# Altium schematic sheet iDAC1.SchDoc: Laser PCB
size A3; DrawnBy: James Singleton; Organization: TMC Technology Ltd.; DocumentNumber: 2; Revision: A; SheetNumber: 3; SheetTotal: 18; Drawn Date: 22/12/2020
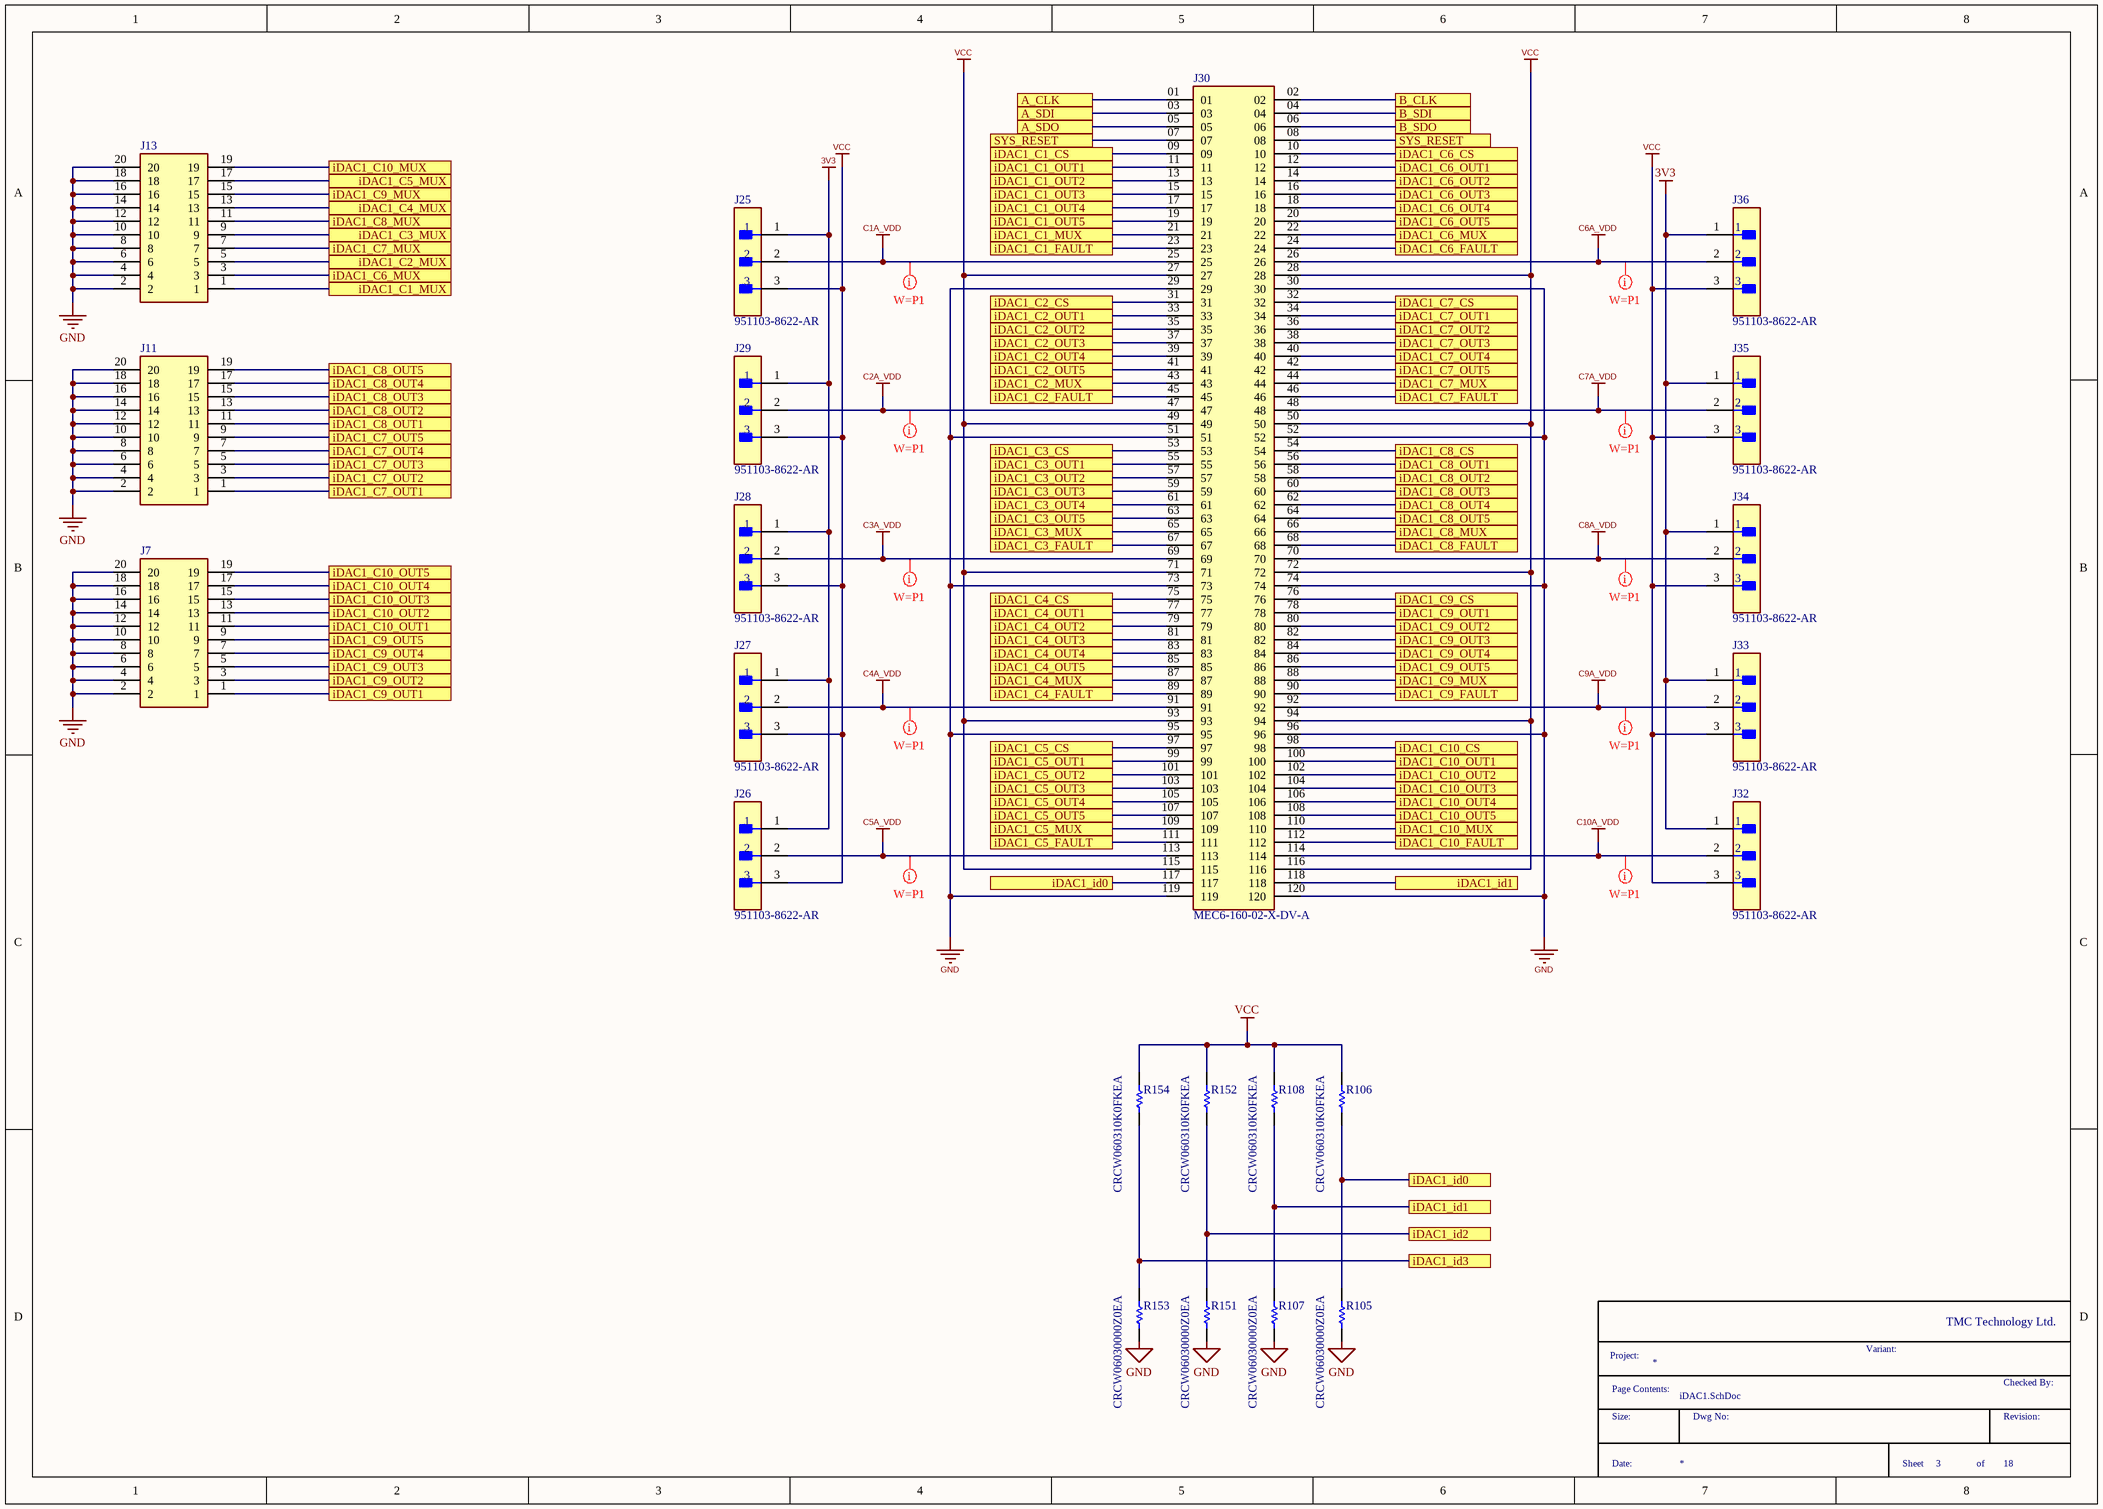
[diagram p0: iDAC1.SchDoc]

## Parts
J7  (no value)  [HDRV20W40P127_2X10_1270X340X550P]
J11  (no value)  [HDRV20W40P127_2X10_1270X340X550P]
J13  (no value)  [HDRV20W40P127_2X10_1270X340X550P]
J25  951103-8622-AR  [FP-951103-8622-AR-MFG]
J26  951103-8622-AR  [FP-951103-8622-AR-MFG]
J27  951103-8622-AR  [FP-951103-8622-AR-MFG]
J28  951103-8622-AR  [FP-951103-8622-AR-MFG]
J29  951103-8622-AR  [FP-951103-8622-AR-MFG]
J30  MEC6-160-02-X-DV-A  [SAMTEC_MEC6-160-02-X-DV-A]
J32  951103-8622-AR  [FP-951103-8622-AR-MFG]
J33  951103-8622-AR  [FP-951103-8622-AR-MFG]
J34  951103-8622-AR  [FP-951103-8622-AR-MFG]
J35  951103-8622-AR  [FP-951103-8622-AR-MFG]
J36  951103-8622-AR  [FP-951103-8622-AR-MFG]
R105  CRCW06030000Z0EA  [RESC1609X50X30NL8T20]
R106  CRCW060310K0FKEA  [RESC1609X50X30NL8T20]
R107  CRCW06030000Z0EA  [RESC1609X50X30NL8T20]
R108  CRCW060310K0FKEA  [RESC1609X50X30NL8T20]
R151  CRCW06030000Z0EA  [RESC1609X50X30NL8T20]
R152  CRCW060310K0FKEA  [RESC1609X50X30NL8T20]
R153  CRCW06030000Z0EA  [RESC1609X50X30NL8T20]
R154  CRCW060310K0FKEA  [RESC1609X50X30NL8T20]

## Ports
A_CLK (see iDAC2[4A], PI_INTERFACE[2B], vDAC1[4A], vDAC2[4A]), A_SDI (see iDAC2[4A], PI_INTERFACE[2B], vDAC1[4A], vDAC2[4A]), A_SDO (see iDAC2[4A], PI_INTERFACE[1B], vDAC1[4A], vDAC2[4A]), B_CLK (see iDAC2[6A], PI_INTERFACE[2B], vDAC1[5A], vDAC2[5A]), B_SDI (see iDAC2[6A], PI_INTERFACE[2B], vDAC1[5A], vDAC2[5A]), B_SDO (see iDAC2[6A], PI_INTERFACE[1B], vDAC1[5A], vDAC2[5A]), iDAC1_C1_CS (see ChipSelects+Faults[6A]), iDAC1_C1_FAULT (see ChipSelects+Faults[1A]), iDAC1_C1_MUX (see iDAC1[2A]), iDAC1_C1_MUX (see iDAC1[4A]), iDAC1_C1_OUT1 (see TX_FlexiConnectors[3A]), iDAC1_C1_OUT2 (see TX_FlexiConnectors[3A]), iDAC1_C1_OUT3 (see TX_FlexiConnectors[3A]), iDAC1_C1_OUT4 (see TX_FlexiConnectors[3A]), iDAC1_C1_OUT5 (see TX_FlexiConnectors[3A]), iDAC1_C2_CS (see ChipSelects+Faults[6A]), iDAC1_C2_FAULT (see ChipSelects+Faults[1A]), iDAC1_C2_MUX (see iDAC1[2A]), iDAC1_C2_MUX (see iDAC1[4B]), iDAC1_C2_OUT1 (see TX_FlexiConnectors[3A]), iDAC1_C2_OUT2 (see TX_FlexiConnectors[3A]), iDAC1_C2_OUT3 (see TX_FlexiConnectors[3A]), iDAC1_C2_OUT4 (see TX_FlexiConnectors[3A]), iDAC1_C2_OUT5 (see TX_FlexiConnectors[3B]), iDAC1_C3_CS (see ChipSelects+Faults[6B]), iDAC1_C3_FAULT (see ChipSelects+Faults[4B]), iDAC1_C3_MUX (see iDAC1[2A]), iDAC1_C3_MUX (see iDAC1[4B]), iDAC1_C3_OUT1 (see TX_FlexiConnectors[3B]), iDAC1_C3_OUT2 (see TX_FlexiConnectors[3C]), iDAC1_C3_OUT3 (see TX_FlexiConnectors[3C]), iDAC1_C3_OUT4 (see TX_FlexiConnectors[3C]), iDAC1_C3_OUT5 (see TX_FlexiConnectors[3C]), iDAC1_C4_CS (see ChipSelects+Faults[6B]), iDAC1_C4_FAULT (see ChipSelects+Faults[1B]), iDAC1_C4_MUX (see iDAC1[2A]), iDAC1_C4_MUX (see iDAC1[4B]), iDAC1_C4_OUT1 (see TX_FlexiConnectors[3C]), iDAC1_C4_OUT2 (see TX_FlexiConnectors[3C]), iDAC1_C4_OUT3 (see TX_FlexiConnectors[3C]), iDAC1_C4_OUT4 (see TX_FlexiConnectors[3C]), iDAC1_C4_OUT5 (see TX_FlexiConnectors[3C]), iDAC1_C5_CS (see ChipSelects+Faults[6B]), iDAC1_C5_FAULT (see ChipSelects+Faults[1B]), iDAC1_C5_MUX (see iDAC1[2A]), iDAC1_C5_MUX (see iDAC1[4C]), iDAC1_C5_OUT1 (see TX_FlexiConnectors[3C]), iDAC1_C5_OUT2 (see TX_FlexiConnectors[1C]), iDAC1_C5_OUT3 (see TX_FlexiConnectors[1C]), iDAC1_C5_OUT4 (see TX_FlexiConnectors[1C]), iDAC1_C5_OUT5 (see TX_FlexiConnectors[1C]), iDAC1_C6_CS (see ChipSelects+Faults[6B]), iDAC1_C6_FAULT (see ChipSelects+Faults[1B]), iDAC1_C6_MUX (see iDAC1[2A]), iDAC1_C6_MUX (see iDAC1[6A]), iDAC1_C6_OUT1 (see TX_FlexiConnectors[1C]), iDAC1_C6_OUT2 (see TX_FlexiConnectors[1C]), iDAC1_C6_OUT3 (see TX_FlexiConnectors[1C]), iDAC1_C6_OUT4 (see TX_FlexiConnectors[1B]), iDAC1_C6_OUT5 (see TX_FlexiConnectors[1B]), iDAC1_C7_CS (see ChipSelects+Faults[6B]), iDAC1_C7_FAULT (see ChipSelects+Faults[1B]), iDAC1_C7_MUX (see iDAC1[2A]), iDAC1_C7_MUX (see iDAC1[6B]), iDAC1_C7_OUT1 (see iDAC1[2B]), iDAC1_C7_OUT1 (see iDAC1[6A]), iDAC1_C7_OUT2 (see iDAC1[2B]), iDAC1_C7_OUT2 (see iDAC1[6A]), iDAC1_C7_OUT3 (see iDAC1[2B]), iDAC1_C7_OUT3 (see iDAC1[6A]), iDAC1_C7_OUT4 (see iDAC1[2B]), iDAC1_C7_OUT4 (see iDAC1[6A]), iDAC1_C7_OUT5 (see iDAC1[2B]), iDAC1_C7_OUT5 (see iDAC1[6A]), iDAC1_C8_CS (see ChipSelects+Faults[6B]), iDAC1_C8_FAULT (see ChipSelects+Faults[1B]), iDAC1_C8_MUX (see iDAC1[2A]), iDAC1_C8_MUX (see iDAC1[6B]), iDAC1_C8_OUT1 (see iDAC1[2B]), iDAC1_C8_OUT1 (see iDAC1[6B]), iDAC1_C8_OUT2 (see iDAC1[2B]), iDAC1_C8_OUT2 (see iDAC1[6B]), iDAC1_C8_OUT3 (see iDAC1[2B]), iDAC1_C8_OUT3 (see iDAC1[6B]), iDAC1_C8_OUT4 (see iDAC1[2B]), iDAC1_C8_OUT4 (see iDAC1[6B]), iDAC1_C8_OUT5 (see iDAC1[2A]), iDAC1_C8_OUT5 (see iDAC1[6B]), iDAC1_C9_CS (see ChipSelects+Faults[6B]), iDAC1_C9_FAULT (see ChipSelects+Faults[1B]), iDAC1_C9_MUX (see iDAC1[2A]), iDAC1_C9_MUX (see iDAC1[6B]), iDAC1_C9_OUT1 (see iDAC1[2B]), iDAC1_C9_OUT1 (see iDAC1[6B]), iDAC1_C9_OUT2 (see iDAC1[2B]), iDAC1_C9_OUT2 (see iDAC1[6B]), iDAC1_C9_OUT3 (see iDAC1[2B]), iDAC1_C9_OUT3 (see iDAC1[6B]), iDAC1_C9_OUT4 (see iDAC1[2B]), iDAC1_C9_OUT4 (see iDAC1[6B]), iDAC1_C9_OUT5 (see iDAC1[2B]), iDAC1_C9_OUT5 (see iDAC1[6B]), iDAC1_C10_CS (see ChipSelects+Faults[6B]), iDAC1_C10_FAULT (see ChipSelects+Faults[1B]), iDAC1_C10_MUX (see iDAC1[2A]), iDAC1_C10_MUX (see iDAC1[6C]), iDAC1_C10_OUT1 (see iDAC1[2B]), iDAC1_C10_OUT1 (see iDAC1[6C]), iDAC1_C10_OUT2 (see iDAC1[2B]), iDAC1_C10_OUT2 (see iDAC1[6C]), iDAC1_C10_OUT3 (see iDAC1[2B]), iDAC1_C10_OUT3 (see iDAC1[6C]), iDAC1_C10_OUT4 (see iDAC1[2B]), iDAC1_C10_OUT4 (see iDAC1[6C]), iDAC1_C10_OUT5 (see iDAC1[2B]), iDAC1_C10_OUT5 (see iDAC1[6C]), iDAC1_id0 (see ChipSelects+Faults[1C], iDAC1[4C]), iDAC1_id0 (see ChipSelects+Faults[1C], iDAC1[6D]), iDAC1_id1 (see iDAC1[6C]), iDAC1_id1 (see iDAC1[6D]), iDAC1_id2, iDAC1_id3, SYS_RESET (see iDAC1[4A], iDAC2[4A], iDAC2[6A], PI_INTERFACE[1C], PIO[5A], PIO[5D], PIO[7B], PIO[7C], vDAC1[4A], vDAC1[5A], vDAC2[3A], vDAC2[5A]), SYS_RESET (see iDAC1[6A], iDAC2[4A], iDAC2[6A], PI_INTERFACE[1C], PIO[5A], PIO[5D], PIO[7B], PIO[7C], vDAC1[4A], vDAC1[5A], vDAC2[3A], vDAC2[5A])

## Nets
3V3: J25.1 J26.1 J27.1 J28.1 J29.1 J32.1 J33.1 J34.1 J35.1 J36.1
C1A_VDD: J25.2 J30.25
C2A_VDD: J29.2 J30.47
C3A_VDD: J28.2 J30.69
C4A_VDD: J27.2 J30.91
C5A_VDD: J26.2 J30.113
C6A_VDD: J30.26 J36.2
C7A_VDD: J30.48 J35.2
C8A_VDD: J30.70 J34.2
C9A_VDD: J30.92 J33.2
C10A_VDD: J30.114 J32.2
GND: J7.2 J7.4 J7.6 J7.8 J7.10 J7.12 J7.14 J7.16 J7.18 J7.20 J11.2 J11.4 J11.6 J11.8 J11.10 J11.12 J11.14 J11.16 J11.18 J11.20 J13.2 J13.4 J13.6 J13.8 J13.10 J13.12 J13.14 J13.16 J13.18 J13.20 J30.29 J30.30 J30.51 J30.52 J30.73 J30.74 J30.95 J30.96 J30.119 J30.120 R105.1 R107.1 R151.1 R153.1
VCC: J25.3 J26.3 J27.3 J28.3 J29.3 J30.27 J30.28 J30.49 J30.50 J30.71 J30.72 J30.93 J30.94 J30.115 J30.116 J32.3 J33.3 J34.3 J35.3 J36.3 R106.2 R108.2 R152.2 R154.2
A_CLK: J30.01 ; port A_CLK
A_SDI: J30.03 ; port A_SDI
A_SDO: J30.05 ; port A_SDO
B_CLK: J30.02 ; port B_CLK
B_SDI: J30.04 ; port B_SDI
B_SDO: J30.06 ; port B_SDO
iDAC1_C1_CS: J30.09 ; port iDAC1_C1_CS
iDAC1_C1_FAULT: J30.23 ; port iDAC1_C1_FAULT
iDAC1_C1_MUX: J13.1 J30.21 ; port iDAC1_C1_MUX
iDAC1_C1_OUT1: J30.11 ; port iDAC1_C1_OUT1
iDAC1_C1_OUT2: J30.13 ; port iDAC1_C1_OUT2
iDAC1_C1_OUT3: J30.15 ; port iDAC1_C1_OUT3
iDAC1_C1_OUT4: J30.17 ; port iDAC1_C1_OUT4
iDAC1_C1_OUT5: J30.19 ; port iDAC1_C1_OUT5
iDAC1_C2_CS: J30.31 ; port iDAC1_C2_CS
iDAC1_C2_FAULT: J30.45 ; port iDAC1_C2_FAULT
iDAC1_C2_MUX: J13.5 J30.43 ; port iDAC1_C2_MUX
iDAC1_C2_OUT1: J30.33 ; port iDAC1_C2_OUT1
iDAC1_C2_OUT2: J30.35 ; port iDAC1_C2_OUT2
iDAC1_C2_OUT3: J30.37 ; port iDAC1_C2_OUT3
iDAC1_C2_OUT4: J30.39 ; port iDAC1_C2_OUT4
iDAC1_C2_OUT5: J30.41 ; port iDAC1_C2_OUT5
iDAC1_C3_CS: J30.53 ; port iDAC1_C3_CS
iDAC1_C3_FAULT: J30.67 ; port iDAC1_C3_FAULT
iDAC1_C3_MUX: J13.9 J30.65 ; port iDAC1_C3_MUX
iDAC1_C3_OUT1: J30.55 ; port iDAC1_C3_OUT1
iDAC1_C3_OUT2: J30.57 ; port iDAC1_C3_OUT2
iDAC1_C3_OUT3: J30.59 ; port iDAC1_C3_OUT3
iDAC1_C3_OUT4: J30.61 ; port iDAC1_C3_OUT4
iDAC1_C3_OUT5: J30.63 ; port iDAC1_C3_OUT5
iDAC1_C4_CS: J30.75 ; port iDAC1_C4_CS
iDAC1_C4_FAULT: J30.89 ; port iDAC1_C4_FAULT
iDAC1_C4_MUX: J13.13 J30.87 ; port iDAC1_C4_MUX
iDAC1_C4_OUT1: J30.77 ; port iDAC1_C4_OUT1
iDAC1_C4_OUT2: J30.79 ; port iDAC1_C4_OUT2
iDAC1_C4_OUT3: J30.81 ; port iDAC1_C4_OUT3
iDAC1_C4_OUT4: J30.83 ; port iDAC1_C4_OUT4
iDAC1_C4_OUT5: J30.85 ; port iDAC1_C4_OUT5
iDAC1_C5_CS: J30.97 ; port iDAC1_C5_CS
iDAC1_C5_FAULT: J30.111 ; port iDAC1_C5_FAULT
iDAC1_C5_MUX: J13.17 J30.109 ; port iDAC1_C5_MUX
iDAC1_C5_OUT1: J30.99 ; port iDAC1_C5_OUT1
iDAC1_C5_OUT2: J30.101 ; port iDAC1_C5_OUT2
iDAC1_C5_OUT3: J30.103 ; port iDAC1_C5_OUT3
iDAC1_C5_OUT4: J30.105 ; port iDAC1_C5_OUT4
iDAC1_C5_OUT5: J30.107 ; port iDAC1_C5_OUT5
iDAC1_C6_CS: J30.10 ; port iDAC1_C6_CS
iDAC1_C6_FAULT: J30.24 ; port iDAC1_C6_FAULT
iDAC1_C6_MUX: J13.3 J30.22 ; port iDAC1_C6_MUX
iDAC1_C6_OUT1: J30.12 ; port iDAC1_C6_OUT1
iDAC1_C6_OUT2: J30.14 ; port iDAC1_C6_OUT2
iDAC1_C6_OUT3: J30.16 ; port iDAC1_C6_OUT3
iDAC1_C6_OUT4: J30.18 ; port iDAC1_C6_OUT4
iDAC1_C6_OUT5: J30.20 ; port iDAC1_C6_OUT5
iDAC1_C7_CS: J30.32 ; port iDAC1_C7_CS
iDAC1_C7_FAULT: J30.46 ; port iDAC1_C7_FAULT
iDAC1_C7_MUX: J13.7 J30.44 ; port iDAC1_C7_MUX
iDAC1_C7_OUT1: J11.1 J30.34 ; port iDAC1_C7_OUT1
iDAC1_C7_OUT2: J11.3 J30.36 ; port iDAC1_C7_OUT2
iDAC1_C7_OUT3: J11.5 J30.38 ; port iDAC1_C7_OUT3
iDAC1_C7_OUT4: J11.7 J30.40 ; port iDAC1_C7_OUT4
iDAC1_C7_OUT5: J11.9 J30.42 ; port iDAC1_C7_OUT5
iDAC1_C8_CS: J30.54 ; port iDAC1_C8_CS
iDAC1_C8_FAULT: J30.68 ; port iDAC1_C8_FAULT
iDAC1_C8_MUX: J13.11 J30.66 ; port iDAC1_C8_MUX
iDAC1_C8_OUT1: J11.11 J30.56 ; port iDAC1_C8_OUT1
iDAC1_C8_OUT2: J11.13 J30.58 ; port iDAC1_C8_OUT2
iDAC1_C8_OUT3: J11.15 J30.60 ; port iDAC1_C8_OUT3
iDAC1_C8_OUT4: J11.17 J30.62 ; port iDAC1_C8_OUT4
iDAC1_C8_OUT5: J11.19 J30.64 ; port iDAC1_C8_OUT5
iDAC1_C9_CS: J30.76 ; port iDAC1_C9_CS
iDAC1_C9_FAULT: J30.90 ; port iDAC1_C9_FAULT
iDAC1_C9_MUX: J13.15 J30.88 ; port iDAC1_C9_MUX
iDAC1_C9_OUT1: J7.1 J30.78 ; port iDAC1_C9_OUT1
iDAC1_C9_OUT2: J7.3 J30.80 ; port iDAC1_C9_OUT2
iDAC1_C9_OUT3: J7.5 J30.82 ; port iDAC1_C9_OUT3
iDAC1_C9_OUT4: J7.7 J30.84 ; port iDAC1_C9_OUT4
iDAC1_C9_OUT5: J7.9 J30.86 ; port iDAC1_C9_OUT5
iDAC1_C10_CS: J30.98 ; port iDAC1_C10_CS
iDAC1_C10_FAULT: J30.112 ; port iDAC1_C10_FAULT
iDAC1_C10_MUX: J13.19 J30.110 ; port iDAC1_C10_MUX
iDAC1_C10_OUT1: J7.11 J30.100 ; port iDAC1_C10_OUT1
iDAC1_C10_OUT2: J7.13 J30.102 ; port iDAC1_C10_OUT2
iDAC1_C10_OUT3: J7.15 J30.104 ; port iDAC1_C10_OUT3
iDAC1_C10_OUT4: J7.17 J30.106 ; port iDAC1_C10_OUT4
iDAC1_C10_OUT5: J7.19 J30.108 ; port iDAC1_C10_OUT5
iDAC1_id0: J30.117 R105.2 R106.1 ; port iDAC1_id0
iDAC1_id1: J30.118 R107.2 R108.1 ; port iDAC1_id1
iDAC1_id2: R151.2 R152.1 ; port iDAC1_id2
iDAC1_id3: R153.2 R154.1 ; port iDAC1_id3
SYS_RESET: J30.07 J30.08 ; port SYS_RESET

## Layout directives
net class PowerOne: C1A_VDD
mark named W=P1: C2A_VDD, C3A_VDD, C4A_VDD, C5A_VDD, C6A_VDD, C7A_VDD, C8A_VDD, C9A_VDD, C10A_VDD

## Notes on the sheet
- TMC Technology Ltd.
- Page Contents:
- Project:
- Variant:
- Checked By:
- Size:
- Date:
- Dwg No:
- Sheet
- of
- Revision:

## Library data of the parts
J7 J11 J13 = 20021111-00020T4LF: Connector; Manufacturer_Name: FCI Electronics; Datasheet Link: https://media.digikey.com/pdf/Data%20Sheets/FCI%20PDFs/Minitek%20127_Catalog.pdf; Height: 5.5mm; Manufacturer_Part_Number: 20021111-00020T4LF
J25-J29 J32-J36 = CMP-05379-000003-1: CONN HEADER VERT 3POS 2MM; Manufacturer: 3M; Conn Gender: Male; Current Rating: 2A; Number Of Contacts: 3; Conn Orientation: Straight; Height: 6.3mm; Digikey Description: CONN HEADER VERT 3POS 2MM; Device Class L3: unset; Category: Conn; Manufacturer Part Number: 951103-8622-AR; RoHS: TRUE; Contact Material: Gold,Nickel; ComponentLink2Description: Datasheet; Temperature Range Low: -55°C; Device Class L1: Connectors; Pitch: 2mm; Mouser Description: Header; PinStrip; CopperAlloy; HighTempThermoplastic; 3Cnts; 1A; RtAngle; 951Series; Octopart: https://octopart.com/951103-8622-ar-3m-14400669; Package: 951103-8622-AR; Lead Free: Yes; Device Class L2: Headers and Wire Housings; Temperature Range High: +125°C; ComponentLink2URL: http://multimedia.3m.com/mws/media/1400506O/3m-pin-strip-header-951-series-78-5100-2653-3.pdf; Automotive: No; Temperature: -55°C to +125°C; Number Of Rows: 1
J30 = MEC6-160-02-X-DV-A: MF: Samtec Inc.; System: Connector; Value: *; Price: None; Package: None; Availability: Unavailable; MP: MEC6-160-02-X-DV-A
R105 R107 R151 R153 = CMP-2000-03816-5: Chip Resistor, 0 Ohm, Jumper, 100 mW, -55 to 155 degC, 0603 (1608 Metric), RoHS, Tape and Reel; Manufacturer: Vishay Semiconductor; Voltage Rating: 75 V; Package Quantity: 5000; DatasheetVersion: 06/2012; Min Operating Temperature: -55 degC; ComponentLink1URL: http://www.vishay.com/; Mounting Technology: Surface Mount; Height: 0.45 mm; ComponentLink1Description: Manufacturer URL; REACH SVHC: Unknown; PackageReference: 0603; Packaging: Tape and Reel; Max Operating Temperature: 155 degC; Mount: Surface Mount; ComponentLink2Description: Datasheet; PackageDescription: 2-Pin Surface Mount Device, Body 1.575 x 0.85 mm; Length: 1.55 mm; ComponentLink2URL: http://www.vishay.com/docs/20035/dcrcwe3.pdf; Pins: 2; RoHSCompliant: true
R106 R108 R152 R154 = CMP-1666-00005-4: Chip Resistor, 10 KOhm, +/- 1%, 100 mW, -55 to 155 degC, 0603 (1608 Metric), RoHS, Tape and Reel; Manufacturer: Vishay Semiconductor; Voltage Rating: 75 V; Max Operating Temperature: 155 degC; PackageDescription: 2-Pin Surface Mount Device, Body 1.575 x 0.85 mm; ComponentLink1Description: Manufacturer URL; RoHSCompliant: true; PackageReference: 0603; REACH SVHC: Unknown; Length: 1.55 mm; DatasheetVersion: 06/2012; Packaging: Tape and Reel; Min Operating Temperature: -55 degC; Mounting Technology: Surface Mount; ComponentLink2URL: https://datasheet.ciiva.com/11809/0900766b80d98afc-11809037.pdf; Height: 0.45 mm; ComponentLink2Description: Datasheet; Package Quantity: 5000; ComponentLink1URL: http://www.vishay.com/